# Altium schematic sheet DCDCProtoPos.SchDoc
size A4
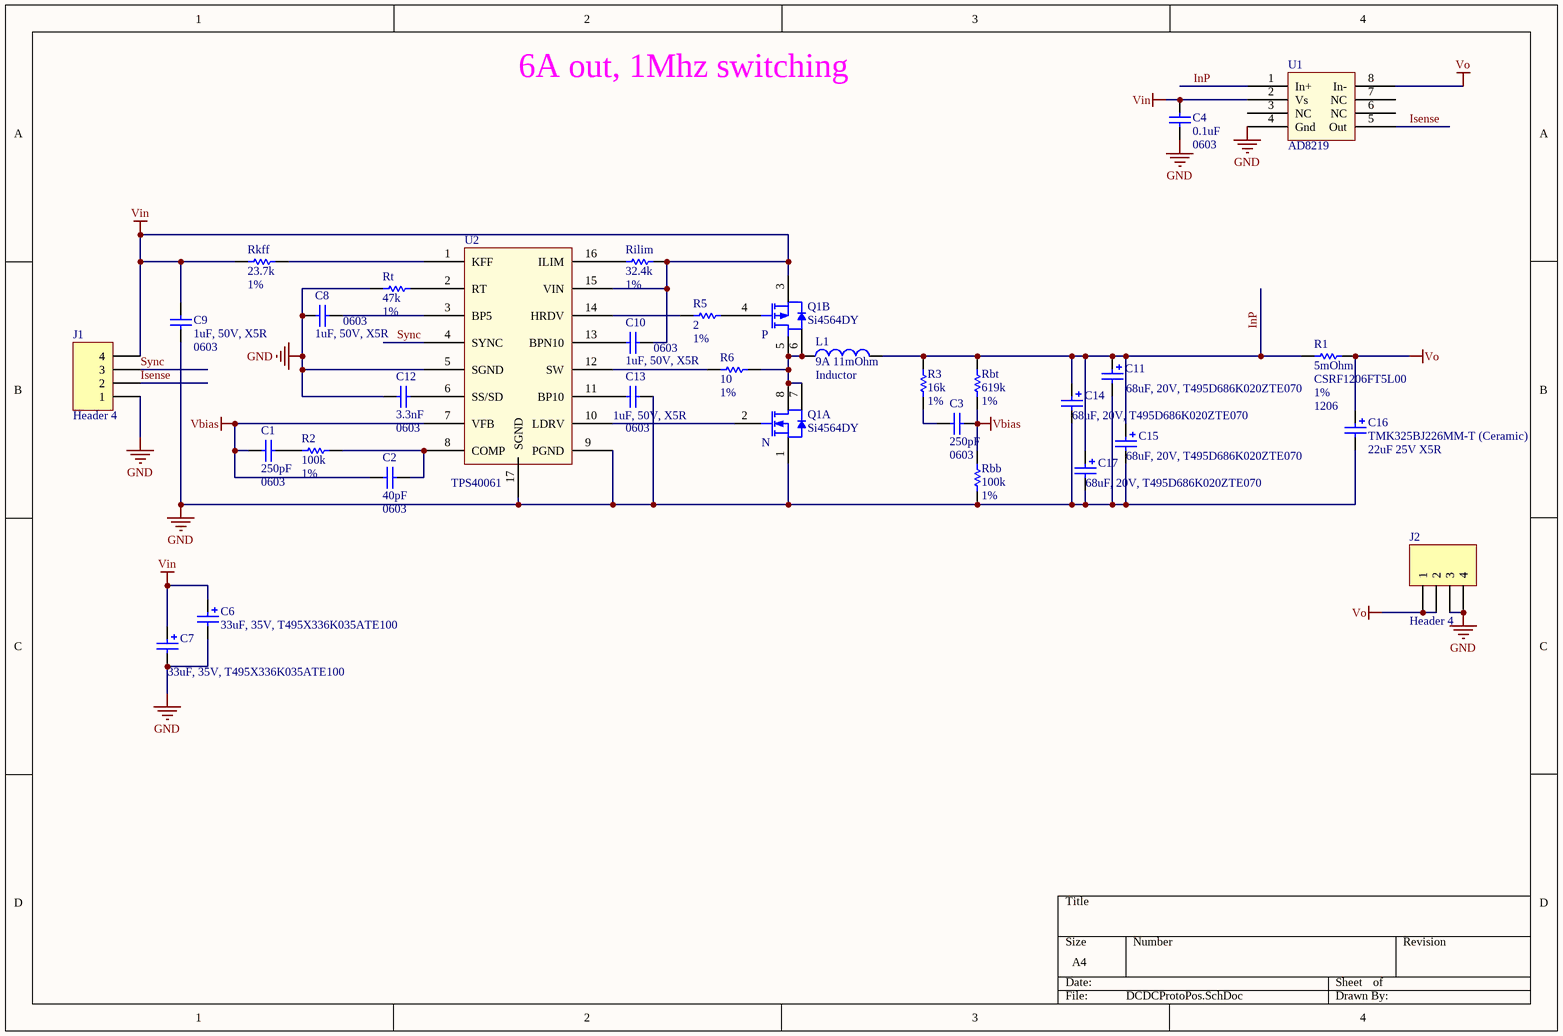
[diagram p0: DCDCProtoPos.SchDoc]

## Parts
C1  250pF  [0603]
C2  40pF  [0603]
C3  250pF  [0603]
C4  0.1uF  [0603]
C6  33uF, 35V, T495X336K035ATE100  [TCASE-D]
C7  33uF, 35V, T495X336K035ATE100  [TCASE-D]
C8  1uF, 50V, X5R  [0603]
C9  1uF, 50V, X5R  [0603]
C10  1uF, 50V, X5R  [0603]
C11  68uF, 20V, T495D686K020ZTE070  [TCASE-D]
C12  3.3nF  [0603]
C13  1uF, 50V, X5R  [0603]
C14  68uF, 20V, T495D686K020ZTE070  [TCASE-D]
C15  68uF, 20V, T495D686K020ZTE070  [TCASE-D]
C16  TMK325BJ226MM-T (Ceramic)  value 22uF 25V X5R  [1210]
C17  68uF, 20V, T495D686K020ZTE070  [TCASE-D]
J1  Header 4  [CON4M]
J2  Header 4  [CON4M]
L1  Inductor  [Wurth744311220]
Q1  Si4564DY  [SO8]  (parts A,B of 2)
R1  5mOhm  value CSRF1206FT5L00  Param: 1%  [1206]
R2  value 100k  Param: 1%  [0603]  (hidden comment: Res0603)
R3  value 16k  Param: 1%  [0603]  (hidden comment: Res0603)
R5  value 2  Param: 1%  [0603]  (hidden comment: Res0603)
R6  value 10  Param: 1%  [0603]  (hidden comment: Res0603)
Rbb  value 100k  Param: 1%  [0603]  (hidden comment: Res0603)
Rbt  value 619k  Param: 1%  [0603]  (hidden comment: Res0603)
Rilim  value 32.4k  Param: 1%  [0603]  (hidden comment: Res0603)
Rkff  value 23.7k  Param: 1%  [0603]  (hidden comment: Res0603)
Rt  value 47k  Param: 1%  [0603]  (hidden comment: Res0603)
U1  AD8219  [MSOP-8]
U2  TPS40061  [TSOP65P640X120_HS-16N]

## Nets
GND: C4.2 C6.2 C7.2 C8.2 C9.1 C11.2 C12.1 C13.2 C14.2 C15.2 C16.2 C17.2 J1.1 J2.3 J2.4 Q1.1(S1) Rbb.1 Rt.1 U1.4(Gnd) U2.5(SGND) U2.9(PGND) U2.17(SGND)
Vbias: C1.2 C2.2 C3.1 Rbb.2 Rbt.1 U2.7(VFB)
Vin: C4.1 C6.1 C7.1 C9.2 C10.1 J1.4 Q1.3(S2) Rilim.2 Rkff.1 U1.2(Vs) U2.15(VIN)
Vo: C16.1 J2.1 J2.2 R1.2 U1.8(In-)
InP: C11.1 C14.1 C15.1 C17.1 L1.2 R1.1 R3.2 Rbt.2 U1.1(In+)
Isense: J1.2 U1.5(Out)
Sync: J1.3 U2.4(SYNC)
NetC1_1: C1.1 R2.2
NetC2_1: C2.1 R2.1 U2.8(COMP)
NetC3_2: C3.2 R3.1
NetC8_1: C8.1 U2.3(BP5)
NetC10_2: C10.2 U2.13(BPN10)
NetC12_2: C12.2 U2.6(SS/SD)
NetC13_1: C13.1 U2.11(BP10)
NetL1_1: L1.1 Q1.5(D2) Q1.6(D2) Q1.7(D1) Q1.8(D1) R6.2
NetQ1_2: Q1.2(G1) U2.10(LDRV)
NetQ1_4: Q1.4(G2) R5.2
NetR5_1: R5.1 U2.14(HRDV)
NetR6_1: R6.1 U2.12(SW)
NetRilim_1: Rilim.1 U2.16(ILIM)
NetRkff_2: Rkff.2 U2.1(KFF)
NetRt_2: Rt.2 U2.2(RT)

Not connected (* = marked no-connect by the designer): U1 3(NC) 6(NC) 7(NC)

## Notes on the sheet
- 6A out, 1Mhz switching
- (in symbol Si4564DY, part A) N
- (in symbol Si4564DY, part B) P
- (in symbol Wurth744311220) 9A 11mOhm

## Library data of the parts
C1-C4 C12 = Cap0603: Capacitor, Ceramic, 0603; TechInf: *; Param1: *
C6 C7 C11 C14 C15 C17 = CapPol3: CAP TANT 68UF 20V 10% 2917 70mOhm; Manufacturer: Kemet; Footprint: 7343-31 (EIA)
  C6 C7: Manufacturers P/N: T495X336K035ATE100
  C11 C14 C15 C17: Manufacturers P/N: T495D686K020ZTE070
C8 C10 C13 = Cap0603: Capacitor, Ceramic, 0603 - UMK107BJ105KA-T; TechInf: *; Param1: *
C9 = Cap0603: UMK107BJ105KA-T; TechInf: *; Param1: *
C16 = Cap Pol3: CAP CER 100UF 10V X5R 1210 20%; Manufacturer: Taiyo Yuden; Manufacturers P/N: LMK325BJ107MM-T; Published: 8-Jun-2000; Publisher: Altium Limited; PackageDescription: Chip Capacitor
J1 J2 = Header 4: Header, 0.1"  4-Pin straight; LatestRevisionDate: 17-Jul-2002; LatestRevisionNote: Re-released for DXP Platform.; Publisher: Altium Limited
L1 = Wurth744311220
R1 = Res1206: Resistor; Param1: 100ppm/C; TechInfo: *
R2 R3 R5 R6 Rbb Rbt Rilim Rkff Rt = Res0603: Resistor; Param1: 100ppm/C; TechInfo: *
U1 = AD8219: Current sense
U2 = TPS40061PWPR: Buck Controller